# Altium schematic sheet can.SchDoc: CAN
size A; Organization: Cal Poly Racing; engineer1: Graydon Wilson
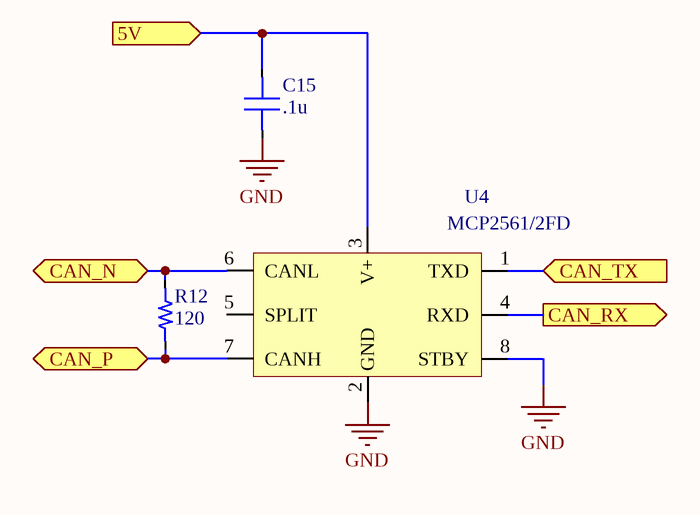
[diagram p0: can.SchDoc]

## Parts
C15  value .1u  [0603_CAP]  (hidden comment: Capacitor)
R12  value 120  [0603_RES]  (hidden comment: Resistor)
U4  MCP2561/2FD  [SOIC-8]

## Ports
5V (in), CAN_N (bidir), CAN_P (bidir), CAN_RX (out), CAN_TX (in)

## Nets
GND: C15.2 U4.2(GND) U4.8(STBY)
5V: C15.1 U4.3(V+) ; port 5V
CAN_N: R12.2 U4.6(CANL) ; port CAN_N
CAN_P: R12.1 U4.7(CANH) ; port CAN_P
CAN_RX: U4.4(RXD) ; port CAN_RX
CAN_TX: U4.1(TXD) ; port CAN_TX

Not connected (* = marked no-connect by the designer): U4 5(SPLIT)

## Notes on the sheet
- Date:
- Time:
- File:

## Library data of the parts
U4 = MCP2561/2FD: 1/1 Transceiver CANbus; Vcc: 5; Name: MCP2561/2FD; Type: CAN; ComponentLink1Description: Digikey; ComponentLink1URL: https://www.digikey.com/product-detail/en/microchip-technology/MCP2561FDT-E-SN/MCP2561FDT-E-SNCT-ND/8637243; ComponentLink2Description: Datasheet; ComponentLink2URL: http://ww1.microchip.com/downloads/en/DeviceDoc/20005284A.pdf
R12 = Resistor: Tolerance: *